# Altium schematic sheet meteostancia_RX.SchDoc
size A4; SheetNumber: 1; SheetTotal: 1
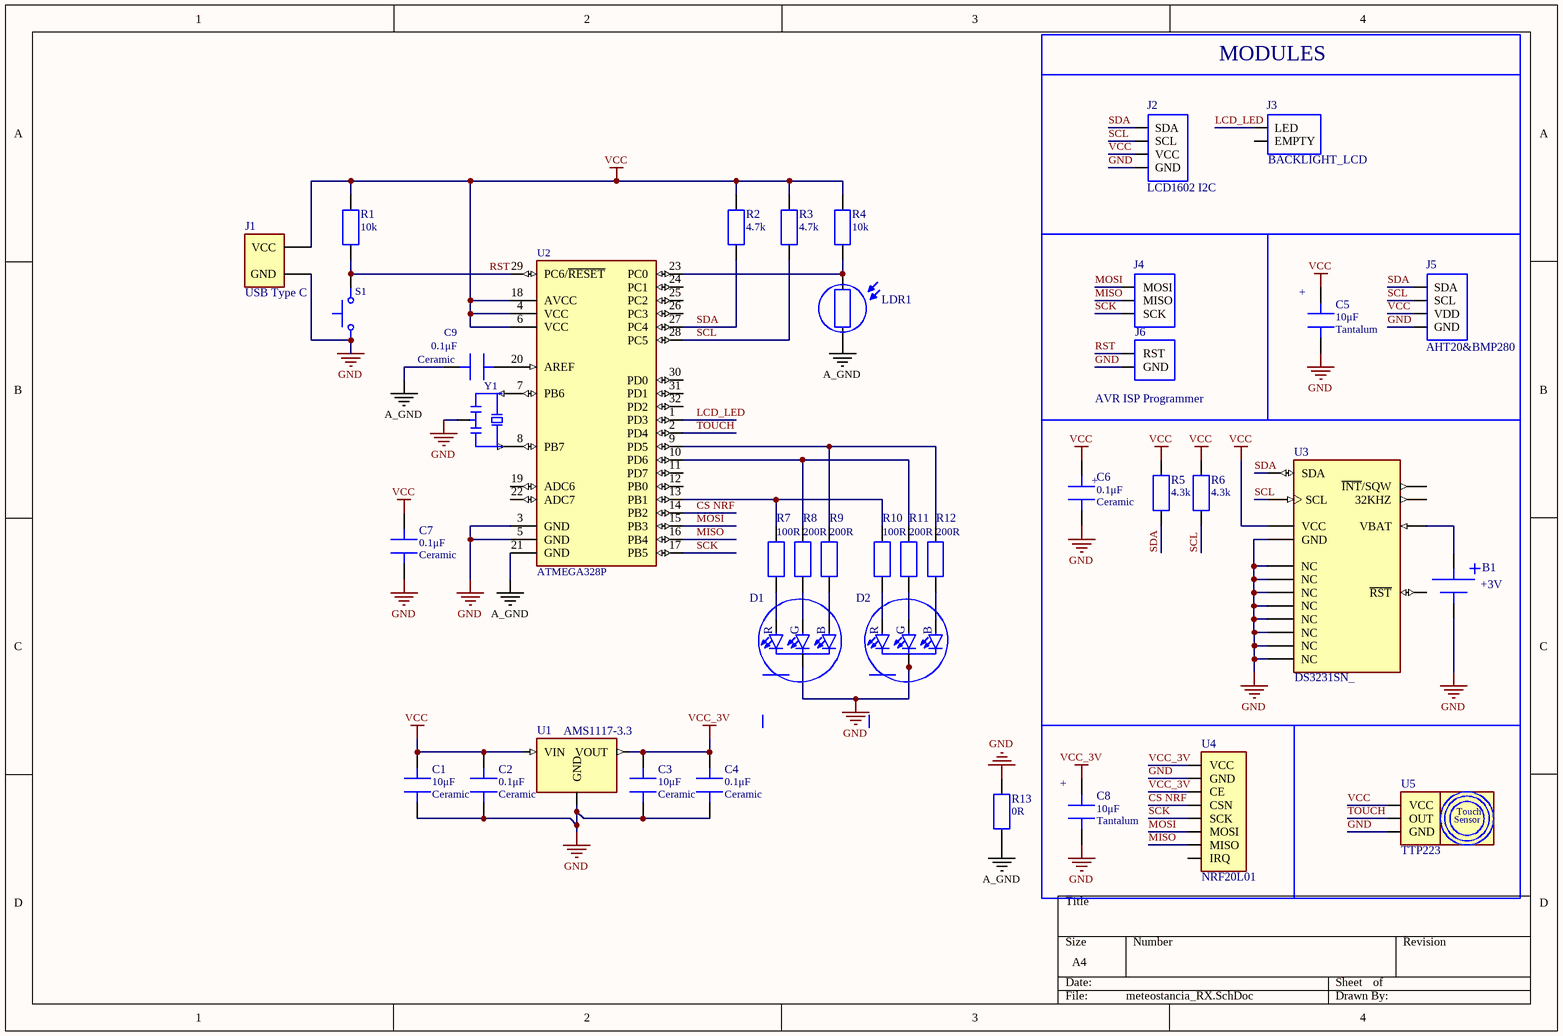
[diagram p0: meteostancia_RX.SchDoc]

## Parts
B1  +3V  [3V Batery]
C1  value 10μF  Types: Ceramic  [0805]  (hidden comment: Capicator)
C2  value 0.1μF  Types: Ceramic  [0805]  (hidden comment: Capicator)
C3  value 10μF  Types: Ceramic  [0805]  (hidden comment: Capicator)
C4  value 0.1μF  Types: Ceramic  [0805]  (hidden comment: Capicator)
C5  value 10μF  Polarity: +  Types: Tantalum  [Capicator 293D size A]  (hidden comment: Capicator)
C6  value 0.1μF  Polarity: +  Types: Ceramic  [0805]  (hidden comment: Capicator)
C7  value 0.1μF  Types: Ceramic  [0603]  (hidden comment: Capicator)
C8  value 10μF  Polarity: +  Types: Tantalum  [Capicator 293D size A]  (hidden comment: Capicator)
C9  value 0.1μF  Types: Ceramic  [0603]  (hidden comment: Capicator)
D1  DIP-LED-RGB  [RGB LED DIP]  (value not drawn)
D2  DIP-LED-RGB  [RGB LED DIP]  (value not drawn)
J1  USB Type C  [18650 PLS 2]
J2  LCD1602 I2C  [PLS-4 - duplicate]
J3  BACKLIGHT_LCD  [PLS-2]
J4  AVR ISP Programmer  [PLS-3]
J5  AHT20&BMP280  [AHT20+BMP280]
J6  AVR ISP Programmer2  [PLS-2]  (value not drawn)
LDR1  photoresistor  [PLS-2]  (value not drawn)
R1  value 10k  [R1206]  (hidden comment: Resistor 1206)
R2  value 4.7k  [R1206]  (hidden comment: Resistor 1206)
R3  value 4.7k  [R1206]  (hidden comment: Resistor 1206)
R4  value 10k  [R1206]  (hidden comment: Resistor 1206)
R5  value 4.3k  [0805]  (hidden comment: Resistor 1206)
R6  value 4.3k  [0805]  (hidden comment: Resistor 1206)
R7  value 100R  [R1206]  (hidden comment: Resistor 1206)
R8  value 200R  [R1206]  (hidden comment: Resistor 1206)
R9  value 200R  [R1206]  (hidden comment: Resistor 1206)
R10  value 100R  [R1206]  (hidden comment: Resistor 1206)
R11  value 200R  [R1206]  (hidden comment: Resistor 1206)
R12  value 200R  [R1206]  (hidden comment: Resistor 1206)
R13  value 0R  [R1206]  (hidden comment: Resistor 1206)
S1  Switch  [Switch arduino]  (value not drawn)
U1  AMS1117-3.3  [AMS1117_SOT229]
U2  ATMEGA328P  [Atmega328]
U3  DS3231SN_  [SOIC_DS3231SN]
U4  NRF20L01  [NRF24L01]
U5  TTP223  [PLS-3]
Y1  Ceramic Resonator  [Ceramic Resonator]  (value not drawn)

## Blocks framed on the sheet
MODULES: B1 C5 C6 C8 J2-J6 R5 R6 U3-U5

## Nets
A_GND: C9.2 LDR1.1 R13.2 U2.21(GND)
GND: B1.2 C1.1 C2.1 C3.1 C4.1 C5.2 C6.2 C7.2 C8.2 D1.2(GND) D2.2(GND) J1.2(GND) J2.1(GND) J5.GND J6.2(GND) R13.1 S1.1 U1.1(GND) U2.3(GND) U2.5(GND) U3.5(NC) U3.6(NC) U3.7(NC) U3.8(NC) U3.9(NC) U3.10(NC) U3.11(NC) U3.12(NC) U3.13(GND) U4.2(GND) U5.3(GND) Y1.2(GND)
VCC: C1.2 C2.2 C5.1 C6.1 C7.1 J1.1(VCC) J2.2(VCC) J5.VDD R1.2 R2.2 R3.2 R4.2 R5.2 R6.2 U1.3(VIN) U2.4(VCC) U2.6(VCC) U2.18(AVCC) U3.2(VCC) U5.1(VCC)
VCC_3V: C3.2 C4.2 C8.1 U1.2(VOUT) U4.1(VCC) U4.3(CE)
CS NRF: U2.14(PB2) U4.4(CSN)
LCD_LED: J3.1(LED) U2.1(PD3)
MISO: J4.2(MISO) U2.16(PB4) U4.7(MISO)
MOSI: J4.1(MOSI) U2.15(PB3) U4.6(MOSI)
RST: J6.1(RST) R1.1 S1.2 U2.29(PC6/~{RESET})
SCK: J4.3(SCK) U2.17(PB5) U4.5(SCK)
SCL: J2.4(SCL) J5.SCL R3.1 R6.1 U2.28(PC5) U3.16(SCL)
SDA: J2.3(SDA) J5.SDA R2.1 R5.1 U2.27(PC4) U3.15(SDA)
TOUCH: U2.2(PD4) U5.2(OUT)
NetB1_1: B1.1 U3.14(VBAT)
NetC9_1: C9.1 U2.20(AREF)
NetD1_1: D1.1(R) R7.1
NetD1_3: D1.3(G) R8.1
NetD1_4: D1.4(B) R9.1
NetD2_1: D2.1(R) R10.1
NetD2_3: D2.3(G) R11.1
NetD2_4: D2.4(B) R12.1
NetLDR1_2: LDR1.2 R4.1 U2.23(PC0)
NetR7_2: R7.2 R10.2 U2.13(PB1)
NetR8_2: R8.2 R11.2 U2.10(PD6)
NetR9_2: R9.2 R12.2 U2.9(PD5)
NetU2_7: U2.7(PB6) Y1.1(IN)
NetU2_8: U2.8(PB7) Y1.3(OUT)

Not connected (* = marked no-connect by the designer): J3 2(EMPTY); U2 11(PD7) 12(PB0) 19(ADC6) 22(ADC7) 24(PC1) 25(PC2) 26(PC3) 30(PD0) 31(PD1) 32(PD2); U3 1(32KHZ) 3(~{INT}/SQW) 4(~{RST}); U4 8(IRQ)

## Notes on the sheet
- (in symbol TTP223) Touch; Sensor

## Library data of the parts
B1 = Baterry 18650
C1-C4 C7 C9 = Capicator: Polarity: +
D1 D2 = DIP-LED-RGB: DIP-LED-RGB catode; MP: WP7113ID; MF: Kingbright; Price: None; Package: Radial Kingbright; Check_prices: https://www.snapeda.com/parts/WP7113ID/Kingbright/view-part/?ref=eda; Purchase-URL: https://pricing.snapeda.com/search/part/WP7113ID/?ref=eda; Availability: In Stock; Value: *; SnapEDA_Link: https://www.snapeda.com/parts/WP7113ID/Kingbright/view-part/?ref=snap
J1 = USB Type C: USB Type C, Power Only, Top mount, Center Height 1.68mm, Single Row, Surface Mount; MF: Amphenol; MP: GSB1C411101DSHR; SnapEDA_Link: https://www.snapeda.com/parts/GSB1C411101DSHR/Amphenol/view-part/?ref=snap; Package: None; Value: *; Check_prices: https://www.snapeda.com/parts/GSB1C411101DSHR/Amphenol/view-part/?ref=eda
J5 = AHT20+BMP280: High Precision Digital Temperature And Humidity Atmospheric Pressure Sensor; MF: Estardyn; SnapEDA_Link: https://www.snapeda.com/parts/AHT20+BMP280/Estardyn/view-part/?ref=snap; Package: None; Value: *; MP: AHT20+BMP280; Check_prices: https://www.snapeda.com/parts/AHT20+BMP280/Estardyn/view-part/?ref=eda
LDR1 = Photoresistor: Value: 10k; Parameter 2: *
R1-R13 = R1206: Parameter 2: *
  R13: ClassName: Resjump
S1 = Switch: MP: TL1105AF160Q; Value: *; Package: None; Price: None; Availability: Unavailable
U1 = AMS1117-3.3: Linear Voltage Regulator IC Positive Fixed 1 Output 1A SOT-223-3L; MF: UMW; SnapEDA_Link: https://www.snapeda.com/parts/AMS1117-3.3/UMW/view-part/?ref=snap; Package: SOT-223-3L UMW; Value: *; MP: AMS1117-3.3; Check_prices: https://www.snapeda.com/parts/AMS1117-3.3/UMW/view-part/?ref=eda
U2 = ATMEGA328P: AVR AVRÂ® ATmega Microcontroller IC 8-Bit 20MHz 32KB (16K x 16) FLASH 32-TQFP (7x7); MF: Microchip Technology / Atmel; MP: ATMEGA328P-AN; SnapEDA_Link: https://www.snapeda.com/parts/ATMEGA328P-AN/Microchip/view-part/?ref=snap; Package: TQFP-32 Microchip Technology / Atmel; Value: *; Check_prices: https://www.snapeda.com/parts/ATMEGA328P-AN/Microchip/view-part/?ref=eda
U3 = DS3231SN_: Real Time Clock (RTC) IC Clock/Calendar - IÂ²C, 2-Wire Serial 16-SOIC (0.295, 7.50mm Width); MF: Maxim Integrated; MP: DS3231SN#; Purchase-URL: https://pricing.snapeda.com/search/part/DS3231SN#/?ref=eda; Package: SOIC-16 Maxim; Value: *; SnapEDA_Link: https://www.snapeda.com/parts/DS3231SN%23/Maxim+Integrated/view-part/?ref=snap; Check_prices: https://www.snapeda.com/parts/DS3231SN%23/Maxim+Integrated/view-part/?ref=eda; Price: None; Availability: In Stock
Y1 = Ceramic Resonator: 16 MHz Ceramic Resonator Built in Capacitor 15 pF Â±0.3% -20Â°C ~ 80Â°C Surface Mount; MF: Murata; MP: CSTCE16M0V53-R0-; SnapEDA_Link: https://www.snapeda.com/parts/CSTCE16M0V53-R0-/Murata/view-part/?ref=snap; Package: None; Value: *; Check_prices: https://www.snapeda.com/parts/CSTCE16M0V53-R0-/Murata/view-part/?ref=eda